# EAGLE design dust_environment_sensor_v3 (EAGLE 6.4)

## Sheet 1 of 5: Microcontroller
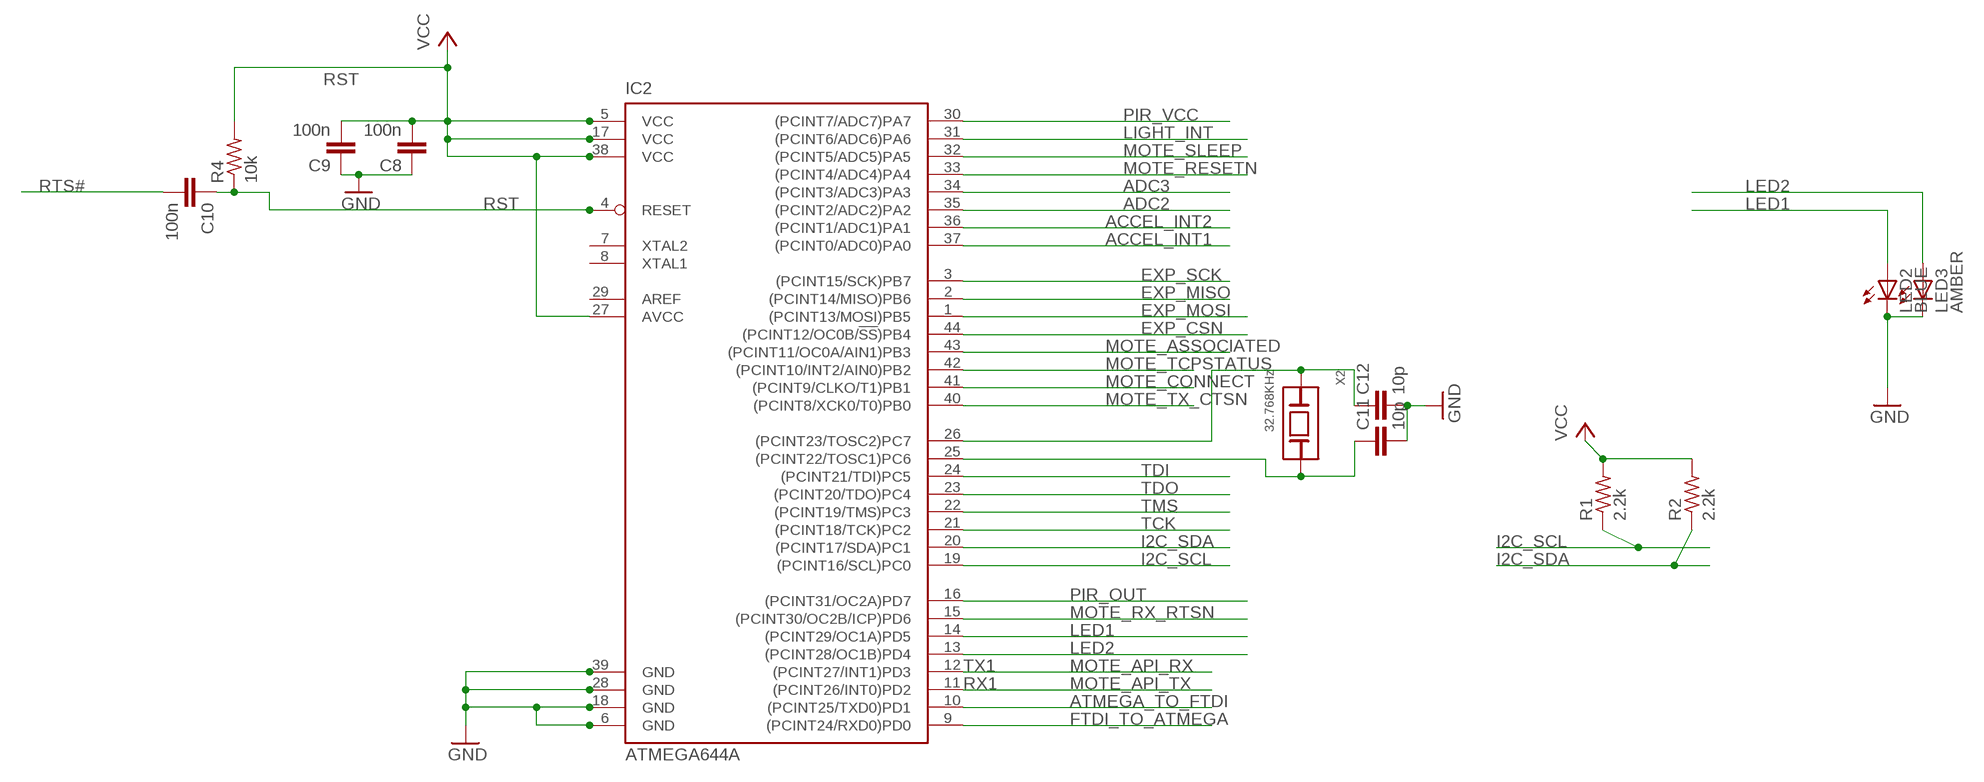
[diagram p0: schematic, sheet 1]

### Parts
C8  100n  C-EUC0603  [C0603]
C9  100n  C-EUC0603  [C0603]
C10  100n  C-EUC0603  [C0603]
C11  10p  C-EUC0603  [C0603]
C12  10p  C-EUC0603  [C0603]
IC2  ATMEGA644A  [TQFP44]
LED2  BLUE  LEDCHIPLED_0805  [CHIPLED_0805]
LED3  AMBER  LEDCHIPLED_0805  [CHIPLED_0805]
R1  2.2k  R-US_R0603  [R0603]
R2  2.2k  R-US_R0603  [R0603]
R4  10k  R-US_R0603  [R0603]
X2  32.768KHz  XTALABS07  [ABS07]

### Nets
ACCEL_INT1: IC2.37((PCINT0/ADC0)PA0) ; also sheet 3
ACCEL_INT2: IC2.36((PCINT1/ADC1)PA1) ; also sheet 3
ADC2: IC2.35((PCINT2/ADC2)PA2) ; also sheet 4
ADC3: IC2.34((PCINT3/ADC3)PA3) ; also sheet 4
ATMEGA_TO_FTDI: IC2.10((PCINT25/TXD0)PD1) ; also sheet 4
EXP_CSN: IC2.44((PCINT12/OC0B/!SS!)PB4) ; also sheet 4
EXP_MISO: IC2.2((PCINT14/MISO)PB6) ; also sheet 4
EXP_MOSI: IC2.1((PCINT13/MOSI)PB5) ; also sheet 4
EXP_SCK: IC2.3((PCINT15/SCK)PB7) ; also sheet 4
FTDI_TO_ATMEGA: IC2.9((PCINT24/RXD0)PD0) ; also sheet 4
GND: C8.1 C9.1 C11.2 C12.2 IC2.6(GND) IC2.18(GND) IC2.28(GND) IC2.39(GND) LED2.C LED3.C ; also sheet 2,3,4,5
I2C_SCL: IC2.19((PCINT16/SCL)PC0) R1.1 ; also sheet 3,4
I2C_SDA: IC2.20((PCINT17/SDA)PC1) R2.1 ; also sheet 3,4
LED1: IC2.14((PCINT29/OC1A)PD5) LED2.A
LED2: IC2.13((PCINT28/OC1B)PD4) LED3.A
LIGHT_INT: IC2.31((PCINT6/ADC6)PA6) ; also sheet 3
MOTE_API_RX: IC2.12((PCINT27/INT1)PD3) ; also sheet 2
MOTE_API_TX: IC2.11((PCINT26/INT0)PD2) ; also sheet 2
MOTE_ASSOCIATED: IC2.43((PCINT11/OC0A/AIN1)PB3) ; also sheet 2
MOTE_CONNECT: IC2.41((PCINT9/CLKO/T1)PB1) ; also sheet 2
MOTE_RESETN: IC2.33((PCINT4/ADC4)PA4) ; also sheet 2
MOTE_RX_RTSN: IC2.15((PCINT30/OC2B/ICP)PD6) ; also sheet 2
MOTE_SLEEP: IC2.32((PCINT5/ADC5)PA5) ; also sheet 2
MOTE_TCPSTATUS: IC2.42((PCINT10/INT2/AIN0)PB2) ; also sheet 2
MOTE_TX_CTSN: IC2.40((PCINT8/XCK0/T0)PB0) ; also sheet 2
N$6: C11.1 IC2.25((PCINT22/TOSC1)PC6) X2.2(B)
N$7: C12.1 IC2.26((PCINT23/TOSC2)PC7) X2.1(A)
PIR_OUT: IC2.16((PCINT31/OC2A)PD7) ; also sheet 3
PIR_VCC: IC2.30((PCINT7/ADC7)PA7) ; also sheet 3
RST: C10.1 IC2.4(RESET) R4.1 ; also sheet 4
RTS#: C10.2 ; also sheet 4
TCK: IC2.21((PCINT18/TCK)PC2) ; also sheet 4
TDI: IC2.24((PCINT21/TDI)PC5) ; also sheet 4
TDO: IC2.23((PCINT20/TDO)PC4) ; also sheet 4
TMS: IC2.22((PCINT19/TMS)PC3) ; also sheet 4
VCC: C8.2 C9.2 IC2.5(VCC) IC2.17(VCC) IC2.27(AVCC) IC2.38(VCC) R1.2 R2.2 R4.2 ; also sheet 2,3,4,5
Unconnected: IC2.7(XTAL2) IC2.8(XTAL1) IC2.29(AREF)

### Notes on the sheet
- TX1
- RX1

## Sheet 2 of 5: Mote
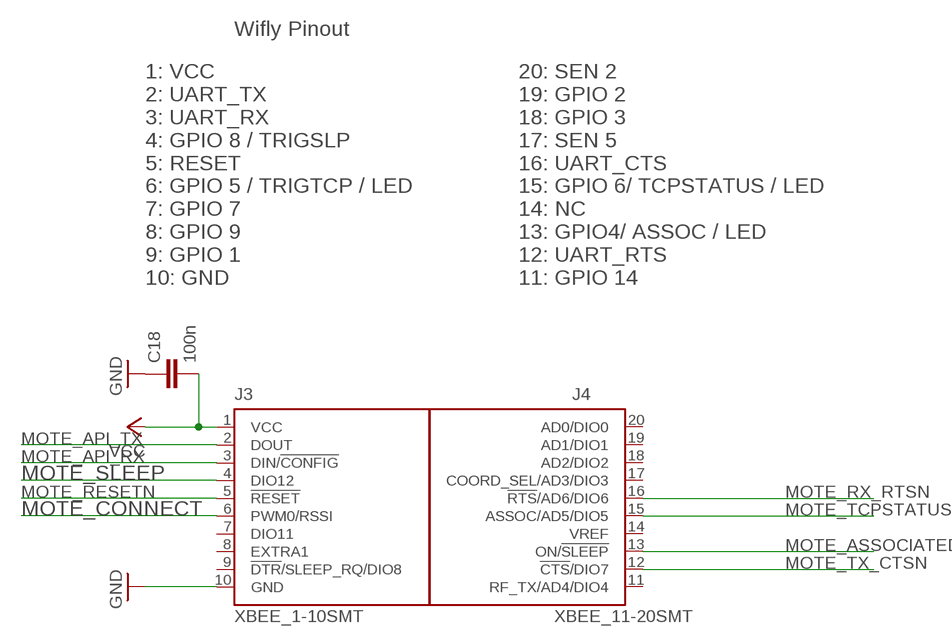
[diagram p1: schematic, sheet 2]

### Parts
C18  100n  C-EUC0603  [C0603]
J3  XBEE_1-10SMT  [XBEE_1-10_SMT]
J4  XBEE_11-20SMT  [XBEE_11-20_SMT]

### Nets
GND: C18.1 J3.10(GND) ; also sheet 1,3,4,5
MOTE_API_RX: J3.3(DIN/!CONFIG) ; also sheet 1
MOTE_API_TX: J3.2(DOUT) ; also sheet 1
MOTE_ASSOCIATED: J4.13(ON/!SLEEP) ; also sheet 1
MOTE_CONNECT: J3.6(PWM0/RSSI) ; also sheet 1
MOTE_RESETN: J3.5(!RESET) ; also sheet 1
MOTE_RX_RTSN: J4.16(!RTS!/AD6/DIO6) ; also sheet 1
MOTE_SLEEP: J3.4(DIO12) ; also sheet 1
MOTE_TCPSTATUS: J4.15(ASSOC/AD5/DIO5) ; also sheet 1
MOTE_TX_CTSN: J4.12(!CTS!/DIO7) ; also sheet 1
VCC: C18.2 J3.1(VCC) ; also sheet 1,3,4,5
Unconnected: J3.7(DIO11) J3.8(EXTRA1) J3.9(!DTR!/SLEEP_RQ/DIO8) J4.11(RF_TX/AD4/DIO4) J4.14(VREF) J4.17(COORD_SEL/AD3/DIO3) J4.18(AD2/DIO2) J4.19(AD1/DIO1) J4.20(AD0/DIO0)

### Notes on the sheet
- Wifly Pinout
- 1: VCC
  2: UART_TX
  3: UART_RX
  4: GPIO 8 / TRIGSLP
  5: RESET
  6: GPIO 5 / TRIGTCP / LED
  7: GPIO 7
  8: GPIO 9
  9: GPIO 1
  10: GND
- 20: SEN 2
  19: GPIO 2
  18: GPIO 3
  17: SEN 5
  16: UART_CTS
  15: GPIO 6/ TCPSTATUS / LED
  14: NC
  13: GPIO4/ ASSOC / LED
  12: UART_RTS
  11: GPIO 14

## Sheet 3 of 5: Sensors
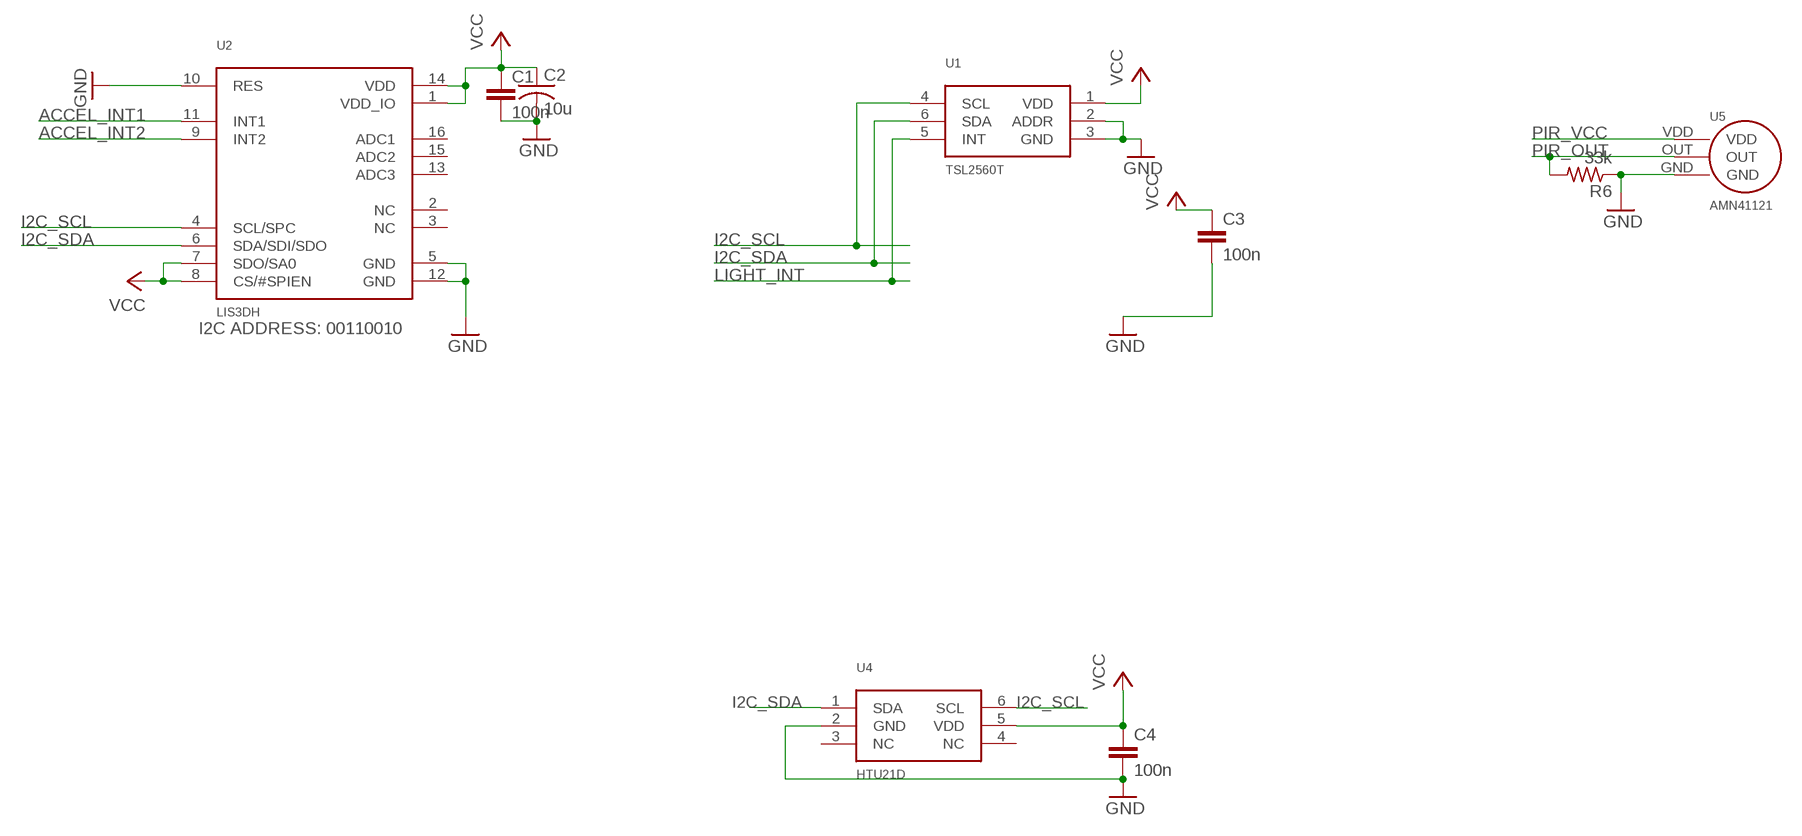
[diagram p2: schematic, sheet 3]

### Parts
C1  100n  C-EUC0603  [C0603]
C2  10u  C-USC0603  [C0603]
C3  100n  C-EUC0603  [C0603]
C4  100n  C-EUC0603  [C0603]
R6  33k  R-US_R0603  [R0603]
U1  TSL2560T  [T_TAOS]
U2  LIS3DH  [LGA16_ST]
U4  HTU21D  [HTU21D]
U5  AMN41121  [AMN41121]

### Nets
ACCEL_INT1: U2.11(INT1) ; also sheet 1
ACCEL_INT2: U2.9(INT2) ; also sheet 1
GND: C1.2 C2.2 C3.2 C4.2 R6.1 U1.2(ADDR) U1.3(GND) U2.5(GND) U2.10(RES) U2.12(GND) U4.2(GND) U5.GND ; also sheet 1,2,4,5
I2C_SCL: U1.4(SCL) U2.4(SCL/SPC) U4.6(SCL) ; also sheet 1,4
I2C_SDA: U1.6(SDA) U2.6(SDA/SDI/SDO) U4.1(SDA) ; also sheet 1,4
LIGHT_INT: U1.5(INT) ; also sheet 1
PIR_OUT: R6.2 U5.OUT ; also sheet 1
PIR_VCC: U5.VDD ; also sheet 1
VCC: C1.1 C2.1 C3.1 C4.1 U1.1(VDD) U2.1(VDD_IO) U2.7(SDO/SA0) U2.8(CS/#SPIEN) U2.14(VDD) U4.5(VDD) ; also sheet 1,2,4,5
Unconnected: U2.2(NC) U2.3(NC) U2.13(ADC3) U2.15(ADC2) U2.16(ADC1) U4.3(NC) U4.4(NC)

### Notes on the sheet
- I2C ADDRESS: 00110010

## Sheet 4 of 5: Connectors
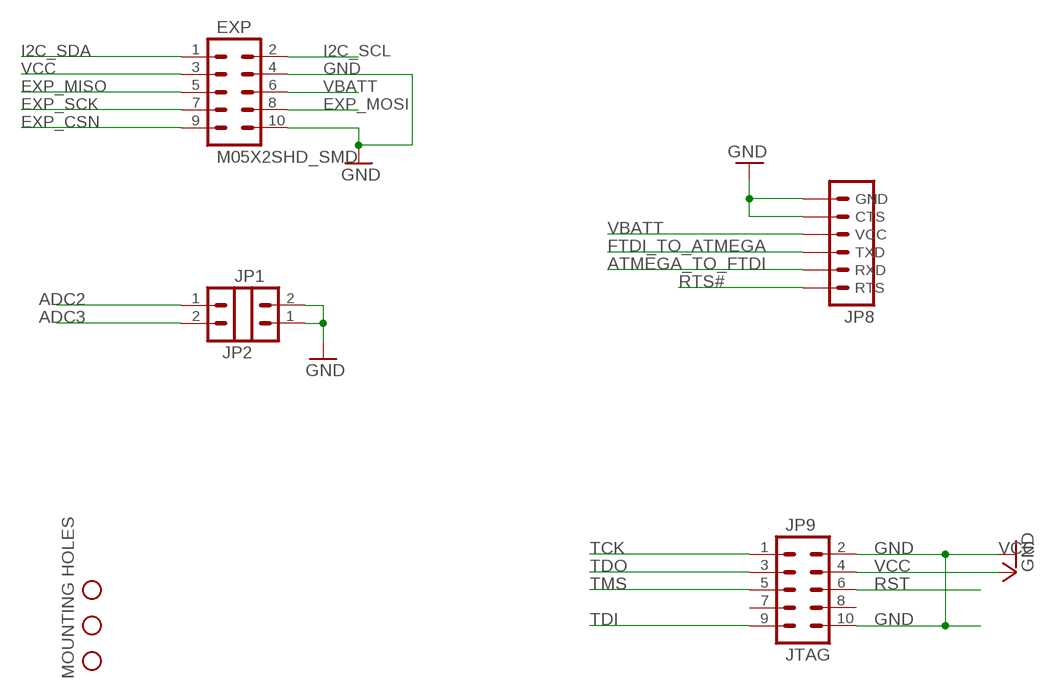
[diagram p3: schematic, sheet 4]

### Parts
EXP  M05X2SHD_SMD  [2X5-SHROUDED_SMD]
JP1  M02PTH  [1X02]
JP2  M02PTH  [1X02]
JP8  FTDI_CABLESIP  [1X06]
JP9  JTAG  M05X2SHD_SMD  [2X5-SHROUDED_SMD]
STANDOFF1  STAND-OFF  [STAND-OFF]
STANDOFF2  STAND-OFF  [STAND-OFF]
STANDOFF3  STAND-OFF  [STAND-OFF]

### Nets
ADC2: JP2.1 ; also sheet 1
ADC3: JP2.2 ; also sheet 1
ATMEGA_TO_FTDI: JP8.5(RXD) ; also sheet 1
EXP_CSN: EXP.9 ; also sheet 1
EXP_MISO: EXP.5 ; also sheet 1
EXP_MOSI: EXP.8 ; also sheet 1
EXP_SCK: EXP.7 ; also sheet 1
FTDI_TO_ATMEGA: JP8.4(TXD) ; also sheet 1
GND: EXP.4 EXP.10 JP1.1 JP1.2 JP8.1(GND) JP8.2(CTS) JP9.2 JP9.10 ; also sheet 1,2,3,5
I2C_SCL: EXP.2 ; also sheet 1,3
I2C_SDA: EXP.1 ; also sheet 1,3
RST: JP9.6 ; also sheet 1
RTS#: JP8.6(RTS) ; also sheet 1
TCK: JP9.1 ; also sheet 1
TDI: JP9.9 ; also sheet 1
TDO: JP9.3 ; also sheet 1
TMS: JP9.5 ; also sheet 1
VBATT: EXP.6 JP8.3(VCC) ; also sheet 5
VCC: EXP.3 JP9.4 ; also sheet 1,2,3,5
Unconnected: JP9.7 JP9.8

### Notes on the sheet
- MOUNTING HOLES

## Sheet 5 of 5: Power Supply
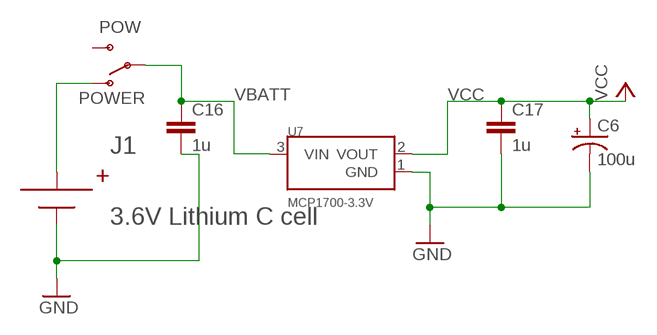
[diagram p4: schematic, sheet 5]

### Parts
C6  100u  CAP_POL7343  [EIA7343]
C16  1u  C-EUC0603  [C0603]
C17  1u  C-EUC0603  [C0603]
J1  3.6V Lithium C cell  BX0036NH  [BX0036_NOHOLES]
POW  POWER  SWITCH-SPDTSMD3  [JS102011SAQN]
U7  MCP1700-3.3V  MCP1700  [SOT23-3]

### Nets
GND: C6.C(-) C16.2 C17.2 J1.NEG U7.1(GND) ; also sheet 1,2,3,4
N$1: J1.POS POW.1(O)
VBATT: C16.1 POW.C(P) U7.3(VIN) ; also sheet 4
VCC: C6.A(+) C17.1 U7.2(VOUT) ; also sheet 1,2,3,4
Unconnected: POW.2(S)

## Library data of the parts
C1 C3 C4 C8-C12 C16-C18 = rcl:C-EU: CAPACITOR, European symbol
C2 = rcl:C-US: CAPACITOR, American symbol
C6 = SparkFun-Capacitors:CAP_POL: Capacitor Polarized These are standard SMD and PTH capacitors. Normally 10uF, 47uF, and 100uF in electrolytic and tantalum varieties. Always verify the external diameter of the through hole cap, it varies with capacity, voltage, and manufacturer. The EIA devices should be standard.
EXP JP9 = SparkFun-Connectors:M05X2: Header 5x2 Standard 10-pin dual row 0.1" header. Commonly used with AVR-ISP. Use with Spark Fun Electronics SKU: PRT-00778
IC2 = atmel:ATMEGA644: 8-bit Microcontroller with 64K Bytes In-System Programmable Flash Source: http://www.atmel.com/dyn/resources/prod_documents/doc2593.pdf; MPN: ATMEGA644PV-10AU; OC_FARNELL: 1455123; OC_NEWARK: 58M3748
J1 = Cool_Electricity:BX0036: BX0036 C-cell battery holder
J3 = Cool_Electricity:XBEE_1-10
J4 = Cool_Electricity:XBEE_11-20
JP1 JP2 = SparkFun-Connectors:M02: Header 2 Standard 2-pin 0.1" header. Use with straight break away headers (SKU : PRT-00116), right angle break away headers (PRT-00553), swiss pins (PRT-00743), machine pins (PRT-00117), and female headers (PRT-00115). Molex polarized connector foot print use with SKU : PRT-08233 with associated crimp pins and housings.
JP8 = custom:FTDI_CABLE: Header 6 Standard 6-pin 0.1" header. Use with straight break away headers (SKU : PRT-00116), right angle break away headers (PRT-00553), swiss pins (PRT-00743), machine pins (PRT-00117), and female headers (PRT-00115). Molex polarized connector foot print use with SKU : PRT-08094 with associated crimp pins and housings. NOTES ON THE VARIANTS LOCK and LOCK_LONGPADS... This footprint was designed to help hold the alignment of a through-hole component (i.e. 6-pin header) while soldering it into place. You may notice that each hole has been shifted either up or down by 0.005 of an inch from it's more standard position (which is a perfectly straight line). This slight alteration caused the pins (the squares in the middle) to touch the edges of the holes. Because they are alternating, it causes a "brace" to hold the component in place. 0.005 has proven to be the perfect amount of "off-center" position when using our standard breakaway headers. Although looks a little odd when you look at the bare footprint, once you have a header in there, the alteration is very hard to notice. Also, if you push a header all the way into place, it is covered up entirely on the bottom side. This idea of altering the position of holes to aid alignment will be further integrated into the Sparkfun Library for other footprints. It can help hold any component with 3 or more connection pins.
LED2 LED3 = led:LED: LED OSRAM: - CHIPLED LG R971, LG N971, LY N971, LG Q971, LY Q971, LO R971, LY R971 LH N974, LH R974 LS Q976, LO Q976, LY Q976 LO Q996 - Hyper CHIPLED LW Q18S LB Q993, LB Q99A, LB R99A - SideLED LS A670, LO A670, LY A670, LG A670, LP A670 LB A673, LV A673, LT A673, LW A673 LH A674 LY A675 LS A676, LA A676, LO A676, LY A676, LW A676 LS A679, LY A679, LG A679 - Hyper Micro SIDELED® LS Y876, LA Y876, LO Y876, LY Y876 LT Y87S - SmartLED LW L88C, LW L88S LB L89C, LB L89S, LG L890 LS L89K, LO L89K, LY L89K LS L896, LA L896, LO L896, LY L896 - TOPLED LS T670, LO T670, LY T670, LG T670, LP T670 LSG T670, LSP T670, LSY T670, LOP T670, LYG T670 LG T671, LOG T671, LSG T671 LB T673, LV T673, LT T673, LW T673 LH T674 LS T676, LA T676, LO T676, LY T676, LB T676, LH T676, LSB T676, LW T676 LB T67C, LV T67C, LT T67C, LS T67K, LO T67K, LY T67K, LW E67C LS E67B, LA E67B, LO E67B, LY E67B, LB E67C, LV E67C, LT E67C LW T67C LS T679, LY T679, LG T679 LS T770, LO T770, LY T770, LG T770, LP T770 LB T773, LV T773, LT T773, LW T773 LH T774 LS E675, LA E675, LY E675, LS T675 LS T776, LA T776, LO T776, LY T776, LB T776 LHGB T686 LT T68C, LB T68C - Hyper Mini TOPLED® LB M676 - Mini TOPLED Santana® LG M470 LS M47K, LO M47K, LY M47K Source: http://www.osram.convergy.de LUXEON: - LUMILED® LXK2-PW12-R00, LXK2-PW12-S00, LXK2-PW14-U00, LXK2-PW14-V00 LXK2-PM12-R00, LXK2-PM12-S00, LXK2-PM14-U00 LXK2-PE12-Q00, LXK2-PE12-R00, LXK2-PE12-S00, LXK2-PE14-T00, LXK2-PE14-U00 LXK2-PB12-K00, LXK2-PB12-L00, LXK2-PB12-M00, LXK2-PB14-N00, LXK2-PB14-P00, LXK2-PB14-Q00 LXK2-PR12-L00, LXK2-PR12-M00, LXK2-PR14-Q00, LXK2-PR14-R00 LXK2-PD12-Q00, LXK2-PD12-R00, LXK2-PD12-S00 LXK2-PH12-R00, LXK2-PH12-S00 LXK2-PL12-P00, LXK2-PL12-Q00, LXK2-PL12-R00 Source: www.luxeon.com KINGBRIGHT: KA-3528ASYC Source: www.kingbright.com
POW = Cool_Electricity:SWITCH-SPDT: SPDT Switch Simple slide switch, Spark Fun Electronics SKU : COM-00102 DPDT SMT slide switch, AYZ0202, SWCH-08179
R1 R2 R4 R6 = resistor:R-US_: RESISTOR, American symbol
STANDOFF1-STANDOFF3 = SparkFun-Electromechanical:STAND-OFF: #4 Stand Off This is the mechanical footprint for a #4 phillips button head screw. Use the keepout ring to avoid running the screw head into surrounding components. SKU : PRT-00447
U1 = Cool_Electricity:TSL2560: TSL2560 Ambient Light Sensor
U2 = Cool_Electricity:LIS3DH: LIS3DH 3-axis accellerometer
U4 = Cool_Electricity:HTU21D: HT21D Temperature/Humidity Sensor
U5 = Cool_Electricity:AMN41121
U7 = Cool_Electricity:MCP1700: MCP1700
X2 = WSNlib:XTAL: Crystals used in OpenMote

## Net classes
0 default: width 0.254 mm, drill 0.33 mm, clearance 0.152 mm
1 power: width 0.254 mm, drill 0.33 mm, clearance 0.152 mm

## Board
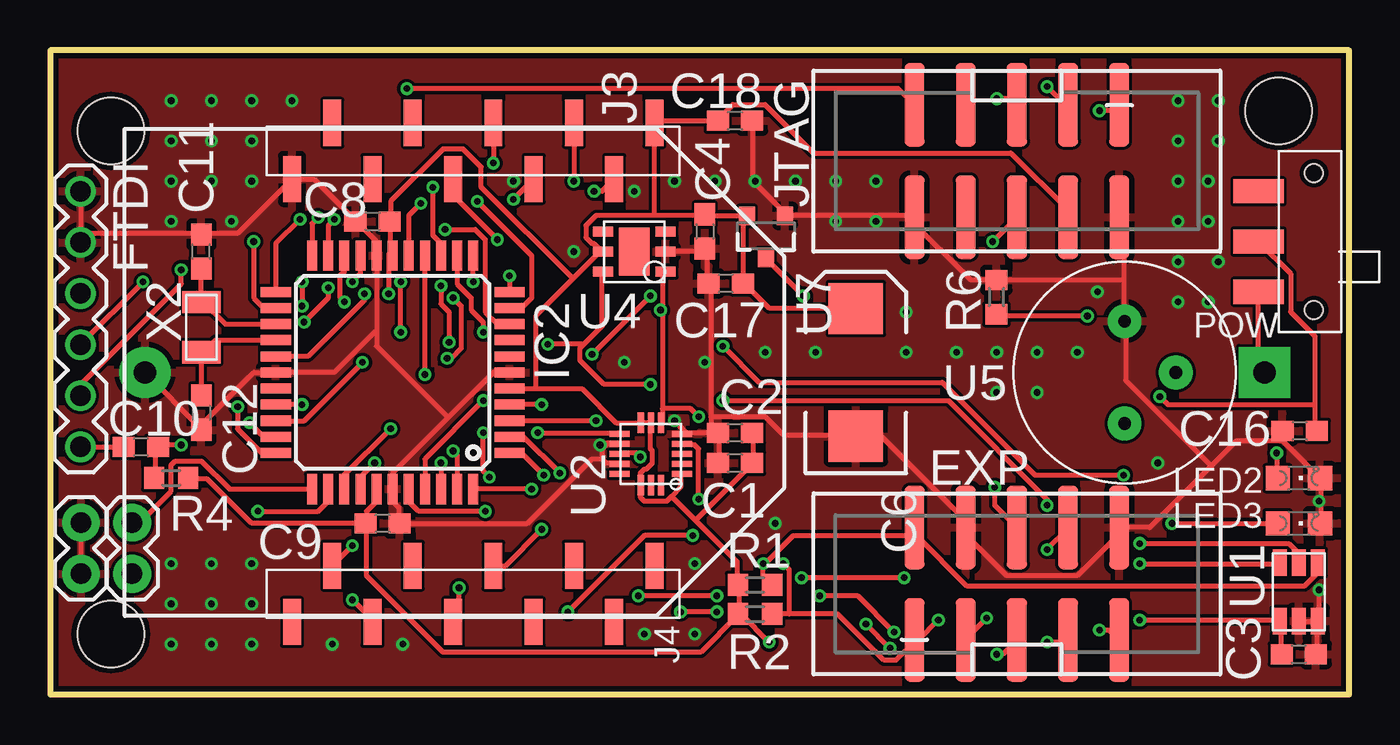
[diagram p5: board, top side]
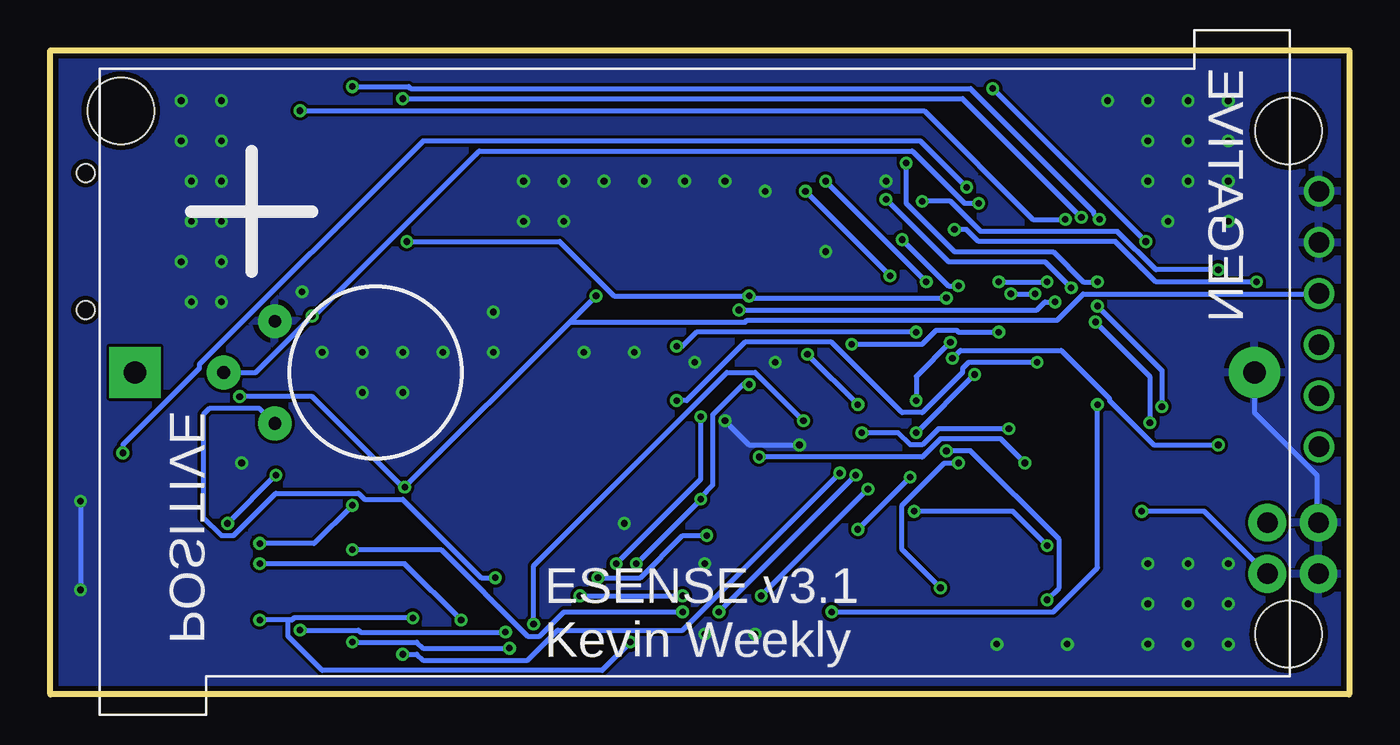
[diagram p6: board, bottom side, seen from below]

Size 64.5 x 32 mm. Coordinates in mm from the lower left corner, seen from the top.
Outline: 0,0 64.5,0 64.5,32 0,32 0,0
Copper layers (1*16): Top 0.035mm / dielectric 1.5mm / Bottom 0.035mm
Design rules "FusionPCB_modified": minimum track width 6mil, minimum drill 12mil, track to track 6mil, track to pad 6mil, pad to pad 6mil, via to via 6mil, smd to smd 0mil, copper to edge 10mil, drill to drill 10mil, minimum pad ring 6mil, minimum via ring 6mil, stop-mask expansion 2mil, vias tented up to drill 100mil, thermal gap 10mil

### Footprints (pad centres in the part's own frame; a part is rotated, then mirrored left to right if it is on the bottom)
C0603 = smd 1.1 x 1: 1 -0.85,0; 2 0.85,0
EIA7343 = smd 2.55 x 2.7: A 3.17,0; C -3.17,0
2X5-SHROUDED_SMD = smd 4.15 x 1: 1 -2.794,5.08; 2 2.794,5.08; 3 -2.794,2.54; 4 2.794,2.54; 5 -2.794,0; 6 2.794,0; 7 -2.794,-2.54; 8 2.794,-2.54; 9 -2.794,-5.08; 10 2.794,-5.08
TQFP44 = smd 1.5 x 0.5: 1 -5.8,4; 2 -5.8,3.2; 3 -5.8,2.4; 4 -5.8,1.6; 5 -5.8,0.8; 6 -5.8,0; 7 -5.8,-0.8; 8 -5.8,-1.6; 9 -5.8,-2.4; 10 -5.8,-3.2; 11 -5.8,-4; 23 5.8,-4; 24 5.8,-3.2; 25 5.8,-2.4; 26 5.8,-1.6; 27 5.8,-0.8; 28 5.8,0; 29 5.8,0.8; 30 5.8,1.6; 31 5.8,2.4; 32 5.8,3.2; 33 5.8,4 | smd 0.5 x 1.5: 12 -4,-5.8; 13 -3.2,-5.8; 14 -2.4,-5.8; 15 -1.6,-5.8; 16 -0.8,-5.8; 17 0,-5.8; 18 0.8,-5.8; 19 1.6,-5.8; 20 2.4,-5.8; 21 3.2,-5.8; 22 4,-5.8; 34 4,5.8; 35 3.2,5.8; 36 2.4,5.8; 37 1.6,5.8; 38 0.8,5.8; 39 0,5.8; 40 -0.8,5.8; 41 -1.6,5.8; 42 -2.4,5.8; 43 -3.2,5.8; 44 -4,5.8
BX0036_NOHOLES = drill 1.1 pad 2.54: NEG 27.8,0 | drill 1.1 pad 2.54 square: POS -27.8,0
XBEE_1-10_SMT = smd 2.29 x 0.89: 1 -12.395,9; 2 -9.605,7; 3 -12.395,5; 4 -9.605,3; 5 -12.395,1; 6 -9.605,-1; 7 -12.395,-3; 8 -9.605,-5; 9 -12.395,-7; 10 -9.605,-9
XBEE_11-20_SMT = smd 2.29 x 0.89: 11 12.395,-9; 12 9.605,-7; 13 12.395,-5; 14 9.605,-3; 15 12.395,-1; 16 9.605,1; 17 12.395,3; 18 9.605,5; 19 12.395,7; 20 9.605,9
1X02 = drill 1.016 pad 1.88: 1 0,0; 2 2.54,0
1X06 = drill 1.016: 1 0,0; 2 2.54,0; 3 5.08,0; 4 7.62,0; 5 10.16,0; 6 12.7,0
CHIPLED_0805 = smd 1.2 x 1.2: A 0,-1.05; C 0,1.05
JS102011SAQN = smd 1.2 x 2.5: 1 -2.5,0; 2 2.5,0; C 0,0 | hole 0.9: -3.4,-2.75; 3.4,-2.75
R0603 = smd 1 x 1.1: 1 -0.85,0; 2 0.85,0
STAND-OFF = hole 3.302: 0,0
T_TAOS = smd 1.3 x 0.7: 1 -1.45,0.95; 2 -1.45,0; 3 -1.45,-0.95; 4 1.45,-0.95; 5 1.45,0; 6 1.45,0.95
LGA16_ST = smd 1 x 0.3: 1 -1.55,1; 2 -1.55,0.5; 3 -1.55,0; 4 -1.55,-0.5; 5 -1.55,-1; 9 1.55,-1; 10 1.55,-0.5; 11 1.55,0; 12 1.55,0.5; 13 1.55,1 | smd 0.3 x 1: 6 -0.5,-1.55; 7 0,-1.55; 8 0.5,-1.55; 14 0.5,1.55; 15 0,1.55; 16 -0.5,1.55
HTU21D = smd 1 x 0.5: 1 -1.55,1; 2 -1.55,0; 3 -1.55,-1; 4 1.55,-1; 5 1.55,0; 6 1.55,1 | smd 1.5 x 2.4: PAD 0,0
AMN41121 = drill 0.635 pad 1.676: GND 0,-2.54; OUT -2.54,0; VDD 0,2.54
SOT23-3 = smd 0.8 x 0.9: 1 -0.95,-1; 2 0.95,-1; 3 0,1.1
ABS07 = smd 1.1 x 1.9: 1 -1.25,0; 2 1.25,0

### Placement (x,y rotation side)
C1  34,11.5 180 top
C2  34,13 180 top
C3  62,2 0 top
C4  32.5,23 270 top
C6  40,16 90 top
C8  16,23.5 0 top
C9  16.5,8.5 180 top
C10  4.5,12.3 180 top
C11  7.5,22 90 top
C12  7.5,14 270 top
C16  62.04,13.1 180 top
C17  33.54,20.42 180 top
C18  34,28.5 180 top
EXP  48,5.5 90 top
IC2  17,16 180 top
J1  32.5,16 0 bottom
J3  21,16 270 top
J4  21,16 270 top
JP1  1.52,6 90 top
JP2  4.06,6 90 top
JP8  1.5,25 270 top
JP9  48,26.5 270 top
LED2  62,10.75 270 top
LED3  62,8.5 270 top
POW  60,22.5 90 top
R1  35,5.45 180 top
R2  35,4 180 top
R4  6,10.75 0 top
R6  46.98,19.74 270 top
STANDOFF1  61,29 0 top
STANDOFF2  3,28 0 top
STANDOFF3  3,3 0 top
U1  62,5.1 90 top
U2  29.82,11.95 180 top
U4  29,22 180 top
U5  53.35,16 180 top
U7  35.54,22.78 180 top
X2  7.5,18.25 90 top

### Tracks (layer width: path | path; a pad name or v marks a point on that pad's centre or on a via)
ACCEL_INT1  (via drill 0.33)
  Top 0.254: v29.3,11.8 29.1,12 28.3,12 U2.11 | v16.1,11.5 15.4,10.8 IC2.37
  Bottom 0.254: v29.3,11.8 21.2,11.8 20.3,12.7 17.3,12.7 v16.1,11.5
ACCEL_INT2  (via drill 0.33)
  Top 0.254: v24.2,13 28.2,13 U2.9 | v16.9,13.2 14.6,10.9 IC2.36
  Bottom 0.254: v24.2,13 22.4,13 21.8,12.4 21.2,12.4 20.4,13.2 v16.9,13.2
ADC2  (via drill 0.33)
  Top 0.254: IC2.35 13.8,9.6 13.3,9.1 v10.3,9.1
  Bottom 0.254: v10.3,9.1 7.2,9.1 4.1,6 JP2.1
ADC3
  Top 0.254: IC2.34 8.9,10.2 7.5,11.6 6.2,11.6 6,11.4 6,10.1 4.5,8.6 4.1,8.6 JP2.2
ATMEGA_TO_FTDI  (via drill 0.33)
  Top 0.254: IC2.10 23.4,19.2 23.9,19.7 23.9,21.8 v21.2,24.5 | v6.5,21.1 6.5,20.4 1.5,15.4 JP8.5
  Bottom 0.254: v21.2,24.5 19.8,24.5 18.3,23 11.5,23 9.6,21.1 v6.5,21.1
EXP_CSN  (via drill 0.33)
  Top 0.254: v23.9,10.2 IC2.44 | v33.1,4.9 v29.2,4.9 | v38.2,4.9 40.1,4.9 v41.9,3.1 | v52.1,3.2 52.6,3.2 53,2.8 EXP.9
  Bottom 0.254: v29.2,4.9 v23.9,10.2 | v38.2,4.9 v33.1,4.9 | v41.9,3.1 49.1,3.1 49.2,3.2 v52.1,3.2
EXP_MISO  (via drill 0.33)
  Top 0.254: IC2.2 23.5,12.8 v25.3,11 | v47,2 47.3,2 EXP.5
  Bottom 0.254: v25.3,11 33.1,3.2 39.3,3.2 40.8,1.7 46,1.7 46.3,2 v47,2
EXP_MOSI  (via drill 0.33)
  Top 0.254: IC2.1 23.4,12 v24.5,10.9 | v33.1,4.1 v31.3,4.1 | v49.5,7.2 50.5,8.2 EXP.8
  Bottom 0.254: v31.3,4.1 v24.5,10.9 | v33.1,4.1 39,4.1 40.2,2.9 40.8,2.9 45.1,7.2 v49.5,7.2
EXP_SCK  (via drill 0.33)
  Top 0.254: v27.1,13.6 IC2.3 | v41.7,2.3 v40.5,3.5 | v49.5,2.6 50.4,2.6 50.5,2.7 EXP.7
  Bottom 0.254: v27.1,13.6 29.5,16 30.9,16 40.5,6.4 v40.5,3.5 | v41.7,2.3 46,2.3 46.3,2.6 v49.5,2.6
FTDI_TO_ATMEGA  (via drill 0.33)
  Top 0.254: IC2.9 22.2,18.4 21.6,19 21.6,22.6 21.1,23.1 v19.6,23.1 | v4.6,20.5 1.5,17.4 JP8.4
  Bottom 0.254: v19.6,23.1 19,23.1 18.4,22.5 11.6,22.5 9.6,20.5 v4.6,20.5
GND  (via drill 0.33)
  Top 0.254: JP1.1 1.5,6 1.5,8.5 JP1.2 | J1.NEG 7.4,13.3 | 7.4,13.3 7.5,13.2 C12.2 7.4,13.3 | 7.4,13.3 10.1,16 IC2.28 14.1,16 16.1,18 16.2,18 | 27.4,11.7 27.6,11.5 28.2,11.5 U2.12 | 27.4,12.2 27.4,11.7 | 27.4,12.2 27.7,12.5 28.2,12.5 U2.10 | 27.4,11.7 26.9,11.7 23.7,8.5 C9.1 17.3,8.5 17.3,9.3 17,9.6 IC2.39 17,11 19.75,13.75 | IC2.6 22,16 19.75,13.75 | JP8.1 JP8.2 1.6,22.9 7.4,22.9 C11.2 7.5,22.9 9.3,22.9 J3.10 12.1,25.6 13.1,25.6 15.1,23.6 C8.1 15.2,23.5 16.2,22.5 IC2.18 16.2,18 | 19.75,13.75 16.2,17.3 16.2,18 | C2.2 31.5,13 | 31.5,13 31.4,13 U2.5 | C1.2 33.2,11.5 33.2,12.9 C2.2 | U4.2 32.4,22 32.5,22.1 C4.2 32.6,22.1 32.6,20.5 C17.2 32.8,20.4 32.8,13.8 | 32.8,13.8 32.8,13.1 C2.2 | 32.8,13.8 35.5,13.8 36.4,12.9 40,12.9 C6.C 40.1,12.8 41.3,12.8 45.4,8.7 45.4,8.3 EXP.4 45.5,8.2 45.5,7.9 47.5,5.9 51,5.9 53.3,8.2 EXP.10 53.1,8.3 54.6,8.3 57.65,11.35 | C3.2 62.9,2 62.9,3.6 U1.3 | U1.2 62,3.6 62.8,3.6 U1.3 | 63.1,9.6 63.1,10.7 LED2.C 61.2,12.6 61.2,13 C16.2 61.1,12.6 58.9,12.6 57.65,11.35 | 63.1,9.6 63.1,8.5 LED3.C | v63,5.2 63,3.7 U1.3 | v63,9.6 63.1,9.6 | 53.3,20.6 53.3,23.5 53.1,23.7 JP9.2 | 53.3,20.6 53.3,18.6 U5.GND 53.4,18.5 53.4,15.6 57.65,11.35 | C18.1 34.9,28.5 34.9,25.5 36.5,23.9 U7.1 36.5,23.8 42.9,23.8 JP9.10 42.6,23.7 45.7,20.6 46.9,20.6 R6.1 47.1,20.6 53.3,20.6 | v27.3,12.4 27.4,12.3 27.4,12.2 | v31,13.6 31.5,13.1 31.5,13
  Bottom 0.254: J1.NEG 4.7,14 1.6,10.9 1.6,8.6 JP1.2 | v63,9.6 v63,5.2 | v27.3,12.4 29.8,12.4 v31,13.6
  other vias: 6,29.5 8,29.5 10,29.5 12,29.5 6,27.5 8,27.5 10,27.5 10,25.5 8,25.5 6,25.5 9,23.5 6,23.5 6,2.5 6,4.5 6,6.5 8,6.5 10,6.5 10,4.5 8,4.5 8,2.5 10,2.5 14,2.5 17.5,2.5 29.5,3 32,6.5 32,3 28.5,16.5 32.5,16.5 35.5,17 38,17 41,23.5 41,25.5 39,25.5 39,23.5 37,25.5 35,25.5 33,25.5 31,25.5 26,22 23,25.5 56,29.5 56,27.5 56,25.5 56,23.5 58,27.5 58,29.5 57.5,25.5 57.5,23.5 56,21.5 58,21.5 56,19.5 57.5,19.5 42.5,19 42.5,17 45,17 47,17 49,17 51,17 49,15 47,15 52,20 55,11.5 36,8.5 29,25
  pour Top: 0,0 64.5,0 64.5,32 0,32
  pour Bottom: 0.5,0 64.5,0 64,32 0,32
I2C_SCL  (via drill 0.33)
  Top 0.254: U1.4 62.9,6.5 62.9,6 62.3,5.4 45.5,5.4 43,7.9 43,8.2 EXP.2 42.9,7.9 36.9,7.9 35.5,6.5 v35.4,6.5 35.4,5.9 35.8,5.5 R1.1 | v32.2,9.7 32.2,12.2 32,12.4 31.4,12.4 U2.4 | 26.45,17.35 26.3,17.2 26.3,16.6 27.5,15.4 v29.8,15.4 | 26.45,17.35 27.4,18.3 27.4,21 U4.6 | IC2.19 15.4,20.9 v15,20.5 | v17.4,18 v17.4,20.5 | v24.7,17.4 26.4,17.4 26.45,17.35
  Bottom 0.254: v35.4,6.5 v32.2,9.7 32.2,9.8 31.6,10.4 31.6,13.9 30.1,15.4 v29.8,15.4 | v17.4,20.5 v15,20.5 | v17.4,18 19.4,18 19.5,18.1 20.5,18.1 21.2,17.4 v24.7,17.4
I2C_SDA  (via drill 0.33)
  Top 0.254: 30.4,19.1 30.4,20.9 30.5,21 U4.1 | 30.4,19.1 30.4,14.2 | 30.4,14.2 30.4,13.5 U2.6 | IC2.20 14.6,21 14.4,20.8 14.4,19.7 v14.6,19.5 | v30.3,19.1 30.4,19.1 | 36.7,4 39.1,4 41.4,1.7 42,1.7 43,2.7 EXP.1 43.1,2.7 v44.1,3.7 | 36.7,4 R2.1 | v54.1,6.5 61,6.5 U1.6 | 30.4,14.2 31.8,14.2 v32.2,13.8 | v36.4,6.5 36.7,6.2 36.7,4
  Bottom 0.254: v14.6,19.5 15.1,19.5 15.5,19.1 v30.3,19.1 | v54.1,6.5 46.9,6.5 v44.1,3.7 | v32.2,13.8 32.2,10.7 v36.4,6.5
LED1  (via drill 0.33)
  Top 0.254: v60.9,12 60.9,10.8 LED2.A | v19,25.2 19,22.8 19.4,22.4 IC2.14
  Bottom 0.254: v60.9,12 60.9,12.4 57.1,16.2 57.1,16.4 46,27.5 21.3,27.5 v19,25.2
LED2  (via drill 0.33)
  Top 0.254: v55.7,8.5 LED3.A | v53.3,10.9 48.9,10.9 44.3,15.5 35.2,15.5 v33.4,17.3 | v21.5,18 21.5,18.5 20.9,19.1 20.9,19.7 20.2,20.4 IC2.13
  Bottom 0.254: v53.3,10.9 v55.7,8.5 | v33.4,17.3 33.1,17.3 32.4,18 v21.5,18
LIGHT_INT  (via drill 0.33)
  Top 0.254: U1.5 62,7 61.5,7.5 v54.1,7.5 | v49.5,9.4 49.5,9.7 44.6,14.6 v33.4,14.6 | v15.5,16.5 12.6,13.6 IC2.31
  Bottom 0.254: v54.1,7.5 51.4,7.5 v49.5,9.4 | v33.4,14.6 32.9,14.6 30,17.5 25.7,17.5 22.2,14 21.2,14 19.2,16 19.2,16.2 18.9,16.5 v15.5,16.5
MOTE_API_RX  (via drill 0.33)
  Top 0.254: v21,20.5 IC2.12 | J3.3 v26,25.5
  Bottom 0.254: v26,25.5 v21,20.5
MOTE_API_TX  (via drill 0.33)
  Top 0.254: v22.8,20.8 IC2.11 | v27,25 27.4,25 J3.2
  Bottom 0.254: v27,25 v22.8,20.8
MOTE_ASSOCIATED  (via drill 0.33)
  Top 0.254: IC2.43 20.2,11.9 v20,12.1 | v15,4.7 16,3.7 J4.13
  Bottom 0.254: v20,12.1 18.8,12.1 14.4,7.7 14.4,5.3 v15,4.7
MOTE_CONNECT  (via drill 0.33)
  Top 0.254: IC2.41 18.6,11.7 v21.5,14.6 | v19.8,17.5 19.8,19 19.4,19.4 v19.4,20.3 | v22.2,22.6 20,24.8 J3.6
  Bottom 0.254: v21.5,14.6 21.5,15.8 v19.8,17.5 | v19.4,20.3 19.9,20.3 v22.2,22.6
MOTE_RESETN  (via drill 0.33)
  Top 0.254: IC2.33 10.5,12 9.3,13.2 v9.3,14.3 | v12.5,20.5 v12.5,19.3 | J3.5 v22,26.4
  Bottom 0.254: v9.3,14.3 9.3,16.1 v12.5,19.3 | v12.5,20.5 13.2,20.5 14.7,22 19.6,22 22,24.4 v22,26.4
MOTE_RX_RTSN  (via drill 0.33)
  Top 0.254: v18.6,15.9 IC2.15 | v21.5,13 21.5,11.1 v21.8,10.8 | v24.4,8.2 22.6,6.4 J4.16
  Bottom 0.254: v21.5,13 v18.6,15.9 | v24.4,8.2 v21.8,10.8
MOTE_SLEEP  (via drill 0.33)
  Top 0.254: IC2.32 10.6,12.8 v9.9,13.5 | v12.6,18.5 13.8,19.7 v13.8,20.2 | v23,24.6 J3.4
  Bottom 0.254: v9.9,13.5 9.9,15.8 v12.6,18.5 | v13.8,20.2 15.1,21.5 19.9,21.5 v23,24.6
MOTE_TCPSTATUS  (via drill 0.33)
  Top 0.254: v19.4,11.5 IC2.42 | v20.3,5.3 20.3,4 20,3.7 J4.15
  Bottom 0.254: v19.4,11.5 20.1,11.5 22.2,9.4 22.2,7.2 v20.3,5.3
MOTE_TX_CTSN  (via drill 0.33)
  Top 0.254: IC2.40 17.8,9.6 18.3,9.1 v21.6,9.1 | v15,7.4 J4.12
  Bottom 0.254: v21.6,9.1 16.7,9.1 v15,7.4
N$1
  Top 0.254: POW.1 60,16.3 J1.POS
N$6
  Top 0.254: C11.1 X2.2 7.6,19.5 8.7,18.4 IC2.25
N$7
  Top 0.254: C12.1 X2.1 7.6,17 8.2,17.6 IC2.26
PIR_OUT  (via drill 0.33)
  Top 0.254: v51.5,18.8 47,18.8 R6.2 | IC2.16 17.8,23.8 v18.4,24.4
  Bottom 0.254: U5.OUT 54.3,16 v51.5,18.8 51.4,18.8 43.2,27 21.7,27 19.1,24.4 v18.4,24.4
PIR_VCC  (via drill 0.33)
  Top 0.254: v12.5,14.4 IC2.30 | v25.7,4.1 29.5,7.9 v31.9,7.9 | v42.4,5.8 v37.3,5.8
  Bottom 0.254: v12.5,14.4 12.5,6.3 14.7,4.1 v25.7,4.1 | v31.9,7.9 33.1,7.9 35.2,5.8 v37.3,5.8 | v42.4,5.8 43.1,5.8 47,9.7 48.9,9.7 49.2,10 53.3,10 55.4,7.9 56,7.9 56.9,8.8 56.9,13.9 56.6,14.2 54.1,14.2 53.4,13.5 U5.VDD
RST  (via drill 0.33)
  Top 0.254: R4.1 5.2,10.8 5.2,12.2 5.3,12.3 C10.1 5.4,12.4 v6.5,12.4 | v24.4,14.4 IC2.4 | v29.8,19.8 v26.9,16.9 | v46.8,22.5 JP9.6 | v19.7,16.7 19.9,16.7 20.4,17.2 20.4,19.3 v20,19.7
  Bottom 0.254: v26.9,16.9 v24.4,14.4 | v46.8,22.5 39.2,22.5 36.5,19.8 v29.8,19.8 29.8,19.7 v20,19.7 | v6.5,12.4 9.7,12.4 11.9,14.6 11.9,14.7 14.3,17.1 19.3,17.1 v19.7,16.7
RTS#
  Top 0.254: JP8.6 C10.2
TCK  (via drill 0.33)
  Top 0.254: IC2.21 13.8,23.3 v14.1,23.6 | v52.1,29 52.8,29 53,29.2 JP9.1
  Bottom 0.254: v14.1,23.6 15.7,23.6 21.1,29 v52.1,29
TDI  (via drill 0.33)
  Top 0.254: IC2.24 10.6,19.2 10.1,19.7 v10.1,22.5 | v17.7,30.1 42.1,30.1 42.9,29.3 JP9.9
  Bottom 0.254: v17.7,30.1 v10.1,22.5
TDO  (via drill 0.33)
  Top 0.254: IC2.23 11.2,22.4 v12.4,23.6 | v49.5,30.2 50.5,29.2 JP9.3
  Bottom 0.254: v12.4,23.6 12.7,23.9 12.7,24 18.8,30.1 46.6,30.1 46.7,30.2 v49.5,30.2
TMS  (via drill 0.33)
  Top 0.254: IC2.22 13,23.4 v13.3,23.7 | v47,29.6 47.7,29.6 JP9.5
  Bottom 0.254: v13.3,23.7 19.2,29.6 v47,29.6
VBATT  (via drill 0.33)
  Top 0.254: 62.8,14.4 62.8,17.8 61.6,19 61.6,20.9 POW.C | 62.8,14.4 62.8,13.1 C16.1 | v37.4,19.8 35.6,21.6 U7.3 | v46.9,10.3 46.9,9.4 EXP.6 | 62.8,14.4 55.5,14.4 v55.1,14.8
  Bottom 0.254: 38.65,18.55 v46.9,10.3 47,10.3 51.5,14.8 v55.1,14.8 | 38.65,18.55 v37.4,19.8 | JP8.3 1.5,19.9 13.2,19.9 14.5,18.6 29.9,18.6 30,18.5 38.6,18.5 38.65,18.55
VCC  (via drill 0.33)
  Top 0.254: IC2.27 12.8,16.8 15.6,19.6 v15.6,19.9 | v16.8,19.9 16.8,21.9 IC2.17 16.9,21.9 16.9,23.5 C8.2 16.9,23.6 16.9,24.5 19.5,27.1 20.5,27.1 21.4,26.2 21.4,25.2 25.95,20.65 | IC2.5 24.1,15.2 | 24.1,15.2 26.4,15.2 28.1,13.5 U2.8 U2.7 29.8,13.4 29.8,12.2 29.9,12.1 29.9,11.5 29.6,11.2 29.5,11.2 29.3,11 29.3,10.5 U2.14 29.3,10.4 29.3,9.8 29.5,9.6 30.6,9.6 30.85,9.85 | 30,23.8 32.4,23.8 C4.1 32.5,23.8 34.5,23.8 U7.2 34.4,23.7 34.4,20.5 C17.1 34.5,20.4 35.7,19.2 40,19.2 C6.A | 30,23.8 27.1,23.8 26.6,23.3 26.6,22.7 26.9,22.4 27,22.4 27.4,22 U4.5 27.3,22 25.95,20.65 | 30,23.8 J3.1 30.1,28.5 C18.2 33.2,28.6 33.9,29.3 35.5,29.3 37.9,26.9 47.7,26.9 50.5,24.1 50.5,23.8 JP9.4 | 24.1,15.2 24.1,18.8 25.95,20.65 | C3.1 61.1,2 61.1,3.6 U1.1 61,3.7 v54.1,3.7 | v46.5,3.8 45.5,2.8 EXP.3 | IC2.38 16.2,9.6 15.7,9.1 15.7,8.5 C9.2 | C9.2 10,8.5 7.8,10.7 6.9,10.7 R4.2 | C2.1 34.9,13 34.9,11.5 C1.1 34.8,11.4 32.05,8.65 | R2.2 34.2,4 34.2,5.4 R1.2 34.1,5.5 34.1,6.6 32.05,8.65 | 30.85,9.85 31.3,10.3 31.3,10.9 U2.1 | 30.85,9.85 32.05,8.65 | C9.2 15.7,8.4 15.7,5.9 19.5,2.1 32.3,2.1 34.1,3.9 R2.2 | v35.7,2.6 34.3,4 R2.2
  Bottom 0.254: v16.8,19.9 v15.6,19.9 | 52.7,3.7 52.5,3.7 52.4,3.8 v46.5,3.8 | 52.7,3.7 v54.1,3.7 | 52.7,3.7 52.7,2.9 51,1.2 37.1,1.2 v35.7,2.6

### Text on the board
tPlace: JTAG
tNames: FTDI | EXP
bNames: NEGATIVE | POSITIVE | ESENSE v3.1 / Kevin Weekly